# Altium schematic sheet Externos_prueba.SchDoc
size A4
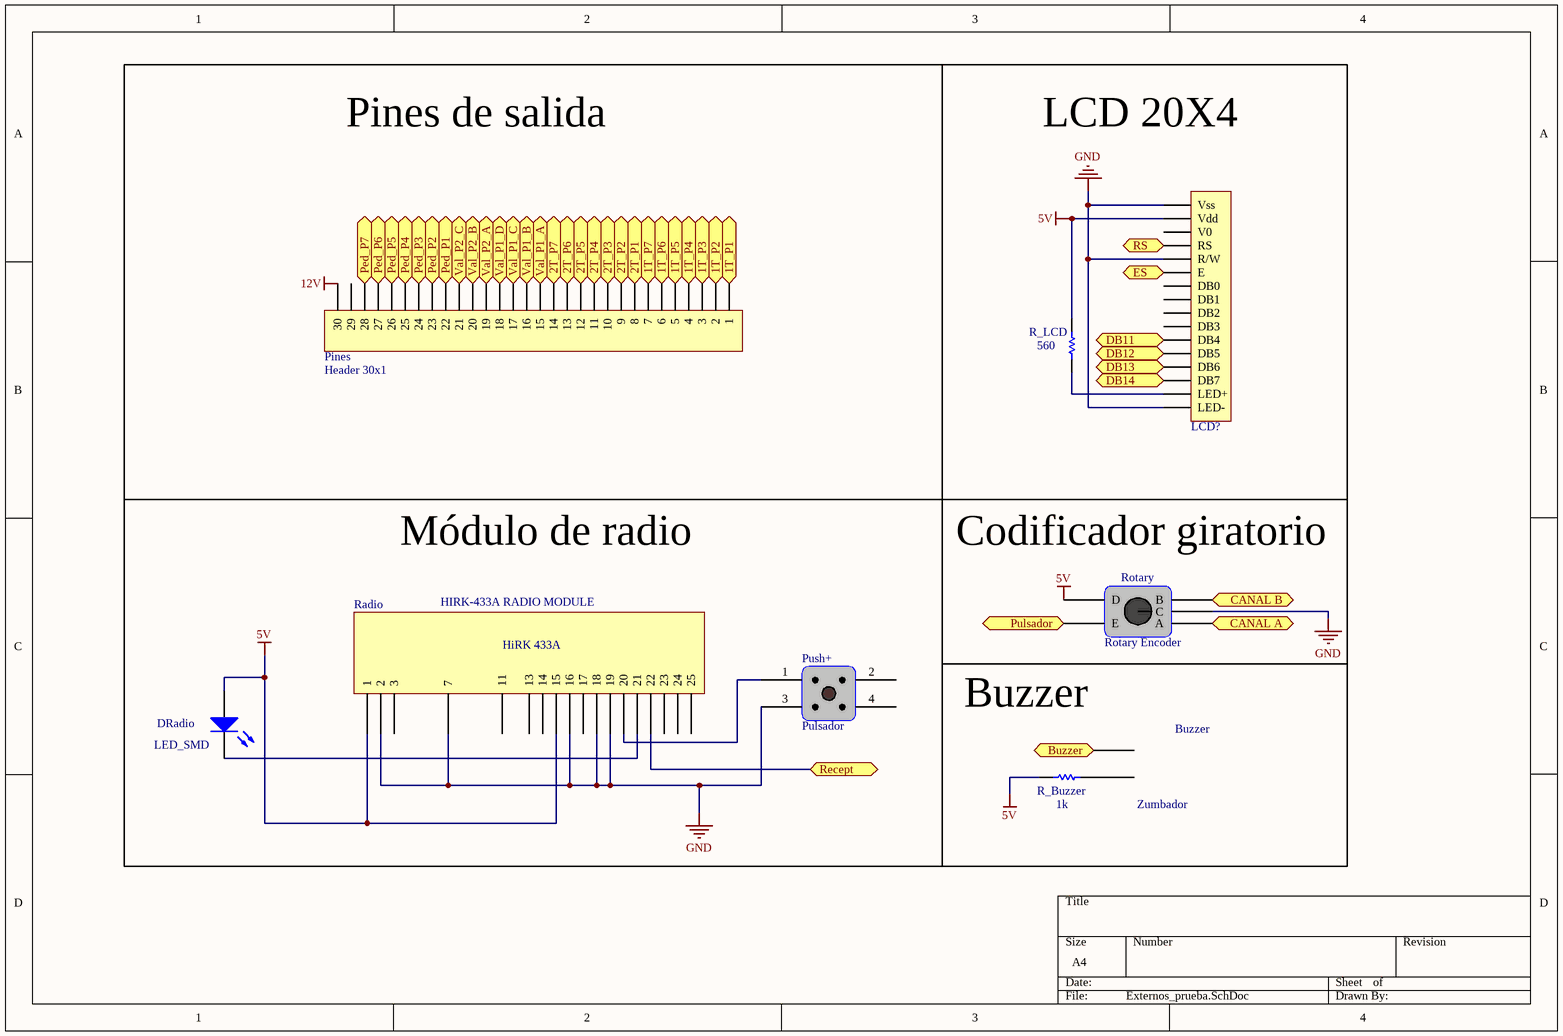
[diagram p0: Externos_prueba.SchDoc]

## Parts
DRadio  LED_SMD  [LED_0805]
LCD?  LCD 20x4  [LCD FORDATA (20x4)]  (value not drawn)
Pines  Header 30x1  [Header 1X30]
Push+  Pulsador  [Pulsador]
R_Buzzer  value 1k  [Resistencia_0805_N]  (hidden comment: Res Chip 0805)
R_LCD  value 560  [Resistencia_0805_N]  (hidden comment: Res Chip 0805)
Radio  HIRK-433A RADIO MODULE  [HIRK-433A Radio Module]
Rotary  Rotary Encoder  [RotaryPCB]
Zumbador  Buzzer  [Buzzer]  (value not drawn)

## Ports
1T_P1, 1T_P2, 1T_P3, 1T_P4, 1T_P5, 1T_P6, 1T_P7, 2T_P1, 2T_P2, 2T_P3, 2T_P4, 2T_P5, 2T_P6, 2T_P7, Buzzer, CANAL A, CANAL B, DB11, DB12, DB13, DB14, ES, Ped_P1, Ped_P2, Ped_P3, Ped_P4, Ped_P5, Ped_P6, Ped_P7, Pulsador, Recept, RS, Val_P1_A, Val_P1_B, Val_P1_C, Val_P1_D, Val_P2_A, Val_P2_B, Val_P2_C

## Nets
5V: DRadio.1(A) LCD?.2(Vdd) R_Buzzer.1 R_LCD.2 Radio.1 Radio.15 Rotary.D
12V: Pines.30
GND: LCD?.1(Vss) LCD?.5(R/W) LCD?.16(LED-) Push+.3 Radio.2 Radio.7 Radio.16 Radio.18 Radio.19 Rotary.C
1T_P1: Pines.1 ; port 1T_P1
1T_P2: Pines.2 ; port 1T_P2
1T_P3: Pines.3 ; port 1T_P3
1T_P4: Pines.4 ; port 1T_P4
1T_P5: Pines.5 ; port 1T_P5
1T_P6: Pines.6 ; port 1T_P6
1T_P7: Pines.7 ; port 1T_P7
2T_P1: Pines.8 ; port 2T_P1
2T_P2: Pines.9 ; port 2T_P2
2T_P3: Pines.10 ; port 2T_P3
2T_P4: Pines.11 ; port 2T_P4
2T_P5: Pines.12 ; port 2T_P5
2T_P6: Pines.13 ; port 2T_P6
2T_P7: Pines.14 ; port 2T_P7
Buzzer: Zumbador.1 ; port Buzzer
CANAL A: Rotary.A ; port CANAL A
CANAL B: Rotary.B ; port CANAL B
DB11: LCD?.11(DB4) ; port DB11
DB12: LCD?.12(DB5) ; port DB12
DB13: LCD?.13(DB6) ; port DB13
DB14: LCD?.14(DB7) ; port DB14
ES: LCD?.6(E) ; port ES
Ped_P1: Pines.22 ; port Ped_P1
Ped_P2: Pines.23 ; port Ped_P2
Ped_P3: Pines.24 ; port Ped_P3
Ped_P4: Pines.25 ; port Ped_P4
Ped_P5: Pines.26 ; port Ped_P5
Ped_P6: Pines.27 ; port Ped_P6
Ped_P7: Pines.28 ; port Ped_P7
Pulsador: Rotary.E ; port Pulsador
Recept: Radio.22 ; port Recept
RS: LCD?.4(RS) ; port RS
Val_P1_A: Pines.15 ; port Val_P1_A
Val_P1_B: Pines.16 ; port Val_P1_B
Val_P1_C: Pines.17 ; port Val_P1_C
Val_P1_D: Pines.18 ; port Val_P1_D
Val_P2_A: Pines.19 ; port Val_P2_A
Val_P2_B: Pines.20 ; port Val_P2_B
Val_P2_C: Pines.21 ; port Val_P2_C
NetDRadio_2: DRadio.2(K) Radio.21
NetLCD?_15: LCD?.15(LED+) R_LCD.1
NetPush+_1: Push+.1 Radio.20
NetR_Buzzer_2: R_Buzzer.2 Zumbador.2

Not connected (* = marked no-connect by the designer): LCD? 3(V0) 7(DB0) 8(DB1) 9(DB2) 10(DB3); Pines 29; Push+ 2 4; Radio 3 11 13 14 17 23 24 25

## Notes on the sheet
- Pines de salida
- LCD 20X4
- Módulo de radio
- (near Rotary) Codificador giratorio
- Buzzer
- (in symbol HIRK-433A RADIO MODULE) HiRK 433A

## Library data of the parts
DRadio = LED_SMD: LED SMD; Published: 8-Jun-2000; LatestRevisionDate: 08-Jul-2005; LatestRevisionNote: Mech Layer 1 removed.; PackageReference: LED-0; Publisher: Altium Limited
R_Buzzer R_LCD = Resistencia: Published: 8-Jun-2000; LatestRevisionDate: 17-Jul-2002; LatestRevisionNote: Re-released for DXP Platform.; PackageReference: AXIAL-0.3; Publisher: Altium Limited; PackageDescription: Axial Device, Thru-Hole; 2 Leads; 0.3 in Pin Spacing
LCD? = LCD 20x4: LatestRevisionDate: 17-Jul-2002; LatestRevisionNote: Re-released for DXP Platform.; Publisher: Altium Limited